# EAGLE schematic BeeTermostat (EAGLE 6.6.0)
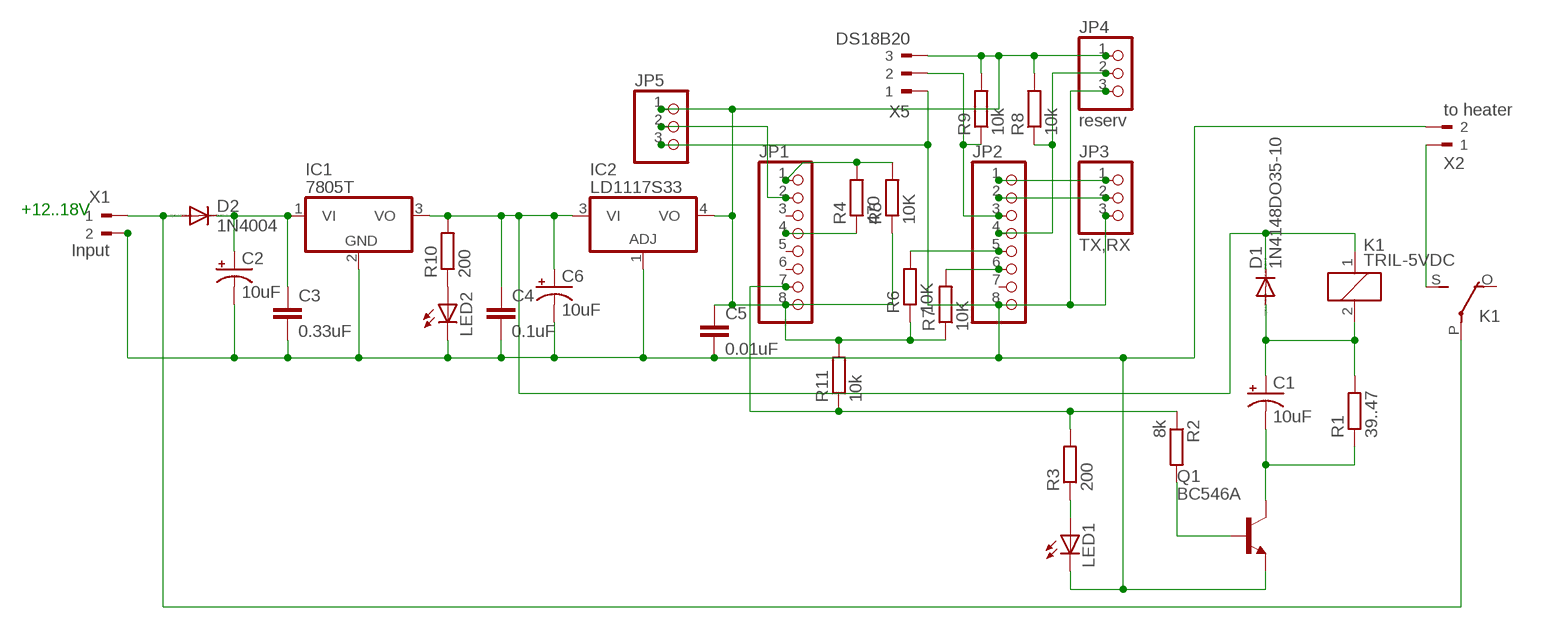
[diagram p0: schematic, sheet 1]

## Parts
C1  10uF  CPOL-USE2.5-5  [E2,5-5]
C2  10uF  CPOL-USE2.5-5  [E2,5-5]
C3  0.33uF  C-EU050-025X075  [C050-025X075]
C4  0.1uF  C-EU050-025X075  [C050-025X075]
C5  0.01uF  C-EUC0805  [C0805]
C6  10uF  CPOL-USE5-8.5  [E5-8,5]
D1  1N4148DO35-10  [DO35-10]
D2  1N4004  [DO41-10]
IC1  7805T  [TO220H]
IC2  LD1117S33  317EMP  [SOT223]
JP1  PINHD-1X8  [1X08]
JP2  PINHD-1X8  [1X08]
JP3  TX,RX  PINHD-1X3  [1X03]
JP4  reserv  PINHD-1X3  [1X03]
JP5  PINHD-1X3  [1X03]
K1  TRIL-5VDC  E3206S  [E3206S]
LED1  LED5MM  [LED5MM]
LED2  LED5MM  [LED5MM]
Q1  BC546A  [TO92-EBC]
R1  39..47  R-EU_0309/12  [0309/12]
R2  8k  R-EU_0309/12  [0309/12]
R3  200  R-EU_0309/12  [0309/12]
R4  470  R-EU_M0805  [M0805]
R5  10K  R-EU_M0805  [M0805]
R6  10K  R-EU_M0805  [M0805]
R7  10K  R-EU_M0805  [M0805]
R8  10k  R-EU_M0805  [M0805]
R9  10k  R-EU_M0805  [M0805]
R10  200  R-EU_0207/10  [0207/10]
R11  10k  R-EU_M0805  [M0805]
X1  Input  90-2  [90-2]
X2  to heater  90-2  [90-2]
X5  DS18B20  90-3  [90-3]

## Nets
N$1: C1.+ D1.A K1.2 R1.2
N$3: C1.- Q1.C R1.1
N$5: JP1.7 R2.1 R3.2 R11.1
N$6: LED1.A R3.1
N$8: C2.+ C3.1 D2.C IC1.1(VI)
N$9: C4.1 C6.+ D1.C IC1.3(VO) IC2.3(VI) K1.1 R10.2
N$10: JP2.3 R9.1 X5.2
N$11: JP2.1 JP3.1
N$12: K1.S(2:S) X2.1
N$13: JP2.2 JP3.2
N$15: JP2.5 R6.2
N$16: JP1.4 R4.1
N$17: JP1.1 R4.2 R5.2
N$18: JP2.6 R7.2
N$19: D2.A K1.P(2:P) X1.1
N$21: JP2.4 JP4.2 R8.1
N$23: C5.1 IC2.4(VO) JP1.8 JP4.1 JP5.1 R5.1 R6.1 R7.1 R8.2 R9.2 R11.2 X5.3
N$24: JP1.2 JP5.2
N$26: LED2.A R10.1
N$41: Q1.B R2.2
N$42: C2.- C3.2 C4.2 C5.2 C6.- IC1.2(GND) IC2.1(ADJ) JP2.8 JP3.3 JP4.3 JP5.3 LED1.K(C) LED2.K(C) Q1.E X1.2 X2.2 X5.1
Unconnected: JP1.3 JP1.5 JP1.6 JP2.7 K1.O(2:O)

## Notes on the sheet
- +12..18V

## Library data of the parts
C1 C2 C6 = rcl:CPOL-US: POLARIZED CAPACITOR, American symbol
C3-C5 = rcl:C-EU: CAPACITOR, European symbol
D1 = diode:1N4148: DIODE high speed (Philips)
D2 = diode:1N4004: DIODE general purpose rectifier, 1 A
IC1 = linear:78*: Positive VOLTAGE REGULATOR Source: http://cache.national.com/ds/LM/LM78L05.pdf http://www.fairchildsemi.com/ds/LM/LM7805.pdf
IC2 = linear:*317: Positive VOLTAGE REGULATOR
JP1 JP2 = pinhead:PINHD-1X8: PIN HEADER
JP3-JP5 = pinhead:PINHD-1X3: PIN HEADER
K1 = relay:E3206S: RELAY 1 x switch, Eichhoff/distributor Schukat; OC_FARNELL: unknown; OC_NEWARK: unknown
LED1 LED2 = led:LED: LED OSRAM: - CHIPLED LG R971, LG N971, LY N971, LG Q971, LY Q971, LO R971, LY R971 LH N974, LH R974 LS Q976, LO Q976, LY Q976 LO Q996 - Hyper CHIPLED LW Q18S LB Q993, LB Q99A, LB R99A - SideLED LS A670, LO A670, LY A670, LG A670, LP A670 LB A673, LV A673, LT A673, LW A673 LH A674 LY A675 LS A676, LA A676, LO A676, LY A676, LW A676 LS A679, LY A679, LG A679 - Hyper Micro SIDELED® LS Y876, LA Y876, LO Y876, LY Y876 LT Y87S - SmartLED LW L88C, LW L88S LB L89C, LB L89S, LG L890 LS L89K, LO L89K, LY L89K LS L896, LA L896, LO L896, LY L896 - TOPLED LS T670, LO T670, LY T670, LG T670, LP T670 LSG T670, LSP T670, LSY T670, LOP T670, LYG T670 LG T671, LOG T671, LSG T671 LB T673, LV T673, LT T673, LW T673 LH T674 LS T676, LA T676, LO T676, LY T676, LB T676, LH T676, LSB T676, LW T676 LB T67C, LV T67C, LT T67C, LS T67K, LO T67K, LY T67K, LW E67C LS E67B, LA E67B, LO E67B, LY E67B, LB E67C, LV E67C, LT E67C LW T67C LS T679, LY T679, LG T679 LS T770, LO T770, LY T770, LG T770, LP T770 LB T773, LV T773, LT T773, LW T773 LH T774 LS E675, LA E675, LY E675, LS T675 LS T776, LA T776, LO T776, LY T776, LB T776 LHGB T686 LT T68C, LB T68C - Hyper Mini TOPLED® LB M676 - Mini TOPLED Santana® LG M470 LS M47K, LO M47K, LY M47K Source: http://www.osram.convergy.de LUXEON: - LUMILED® LXK2-PW12-R00, LXK2-PW12-S00, LXK2-PW14-U00, LXK2-PW14-V00 LXK2-PM12-R00, LXK2-PM12-S00, LXK2-PM14-U00 LXK2-PE12-Q00, LXK2-PE12-R00, LXK2-PE12-S00, LXK2-PE14-T00, LXK2-PE14-U00 LXK2-PB12-K00, LXK2-PB12-L00, LXK2-PB12-M00, LXK2-PB14-N00, LXK2-PB14-P00, LXK2-PB14-Q00 LXK2-PR12-L00, LXK2-PR12-M00, LXK2-PR14-Q00, LXK2-PR14-R00 LXK2-PD12-Q00, LXK2-PD12-R00, LXK2-PD12-S00 LXK2-PH12-R00, LXK2-PH12-S00 LXK2-PL12-P00, LXK2-PL12-Q00, LXK2-PL12-R00 Source: www.luxeon.com KINGBRIGHT: KA-3528ASYC Source: www.kingbright.com
Q1 = transistor-npn:BC546*: NPN Transistor
R1-R11 = rcl:R-EU_: RESISTOR, European symbol
X1 X2 = con-weidmueller-sl35:90-2: WEIDMUELLER CLAMP CONNECTOR; OC_FARNELL: unknown; OC_NEWARK: unknown
X5 = con-weidmueller-sl35:90-3: WEIDMUELLER CLAMP CONNECTOR; OC_FARNELL: unknown; OC_NEWARK: unknown